# EAGLE design Feather_RCSwitch (EAGLE 9.3.0)
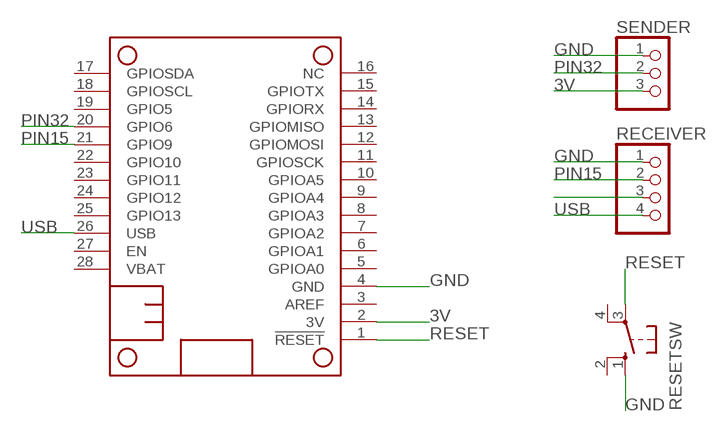
[diagram p0: schematic, sheet 1]

## Parts
MS1  FEATHERWING  [FEATHERWING]
RECEIVER  PINHD-1X4  [1X04]
RESETSW  10-XX  [B3F-10XX]
SENDER  PINHD-1X3  [1X03]

## Nets
3V: MS1.2(3V) SENDER.3
GND: MS1.4(GND) RECEIVER.1 RESETSW.1(S) SENDER.1
N$9: RECEIVER.3
PIN15: MS1.21(GPIO9) RECEIVER.2
PIN32: MS1.20(GPIO6) SENDER.2
RESET: MS1.1(!RESET) RESETSW.3(P)
USB: MS1.26(USB) RECEIVER.4
Unconnected: MS1.3(AREF) MS1.5(GPIOA0) MS1.6(GPIOA1) MS1.7(GPIOA2) MS1.8(GPIOA3) MS1.9(GPIOA4) MS1.10(GPIOA5) MS1.11(GPIOSCK) MS1.12(GPIOMOSI) MS1.13(GPIOMISO) MS1.14(GPIORX) MS1.15(GPIOTX) MS1.16(NC) MS1.17(GPIOSDA) MS1.18(GPIOSCL) MS1.19(GPIO5) MS1.22(GPIO10) MS1.23(GPIO11) MS1.24(GPIO12) MS1.25(GPIO13) MS1.27(EN) MS1.28(VBAT) RESETSW.2(S1) RESETSW.4(P1)

## Library data of the parts
MS1 = adafruit:FEATHERWING
RECEIVER = pinhead:PINHD-1X4: PIN HEADER
RESETSW = switch-omron:10-XX: OMRON SWITCH; MPN: B3F-1000; OC_FARNELL: 176432; OC_NEWARK: 36M3542
SENDER = pinhead:PINHD-1X3: PIN HEADER

## Board
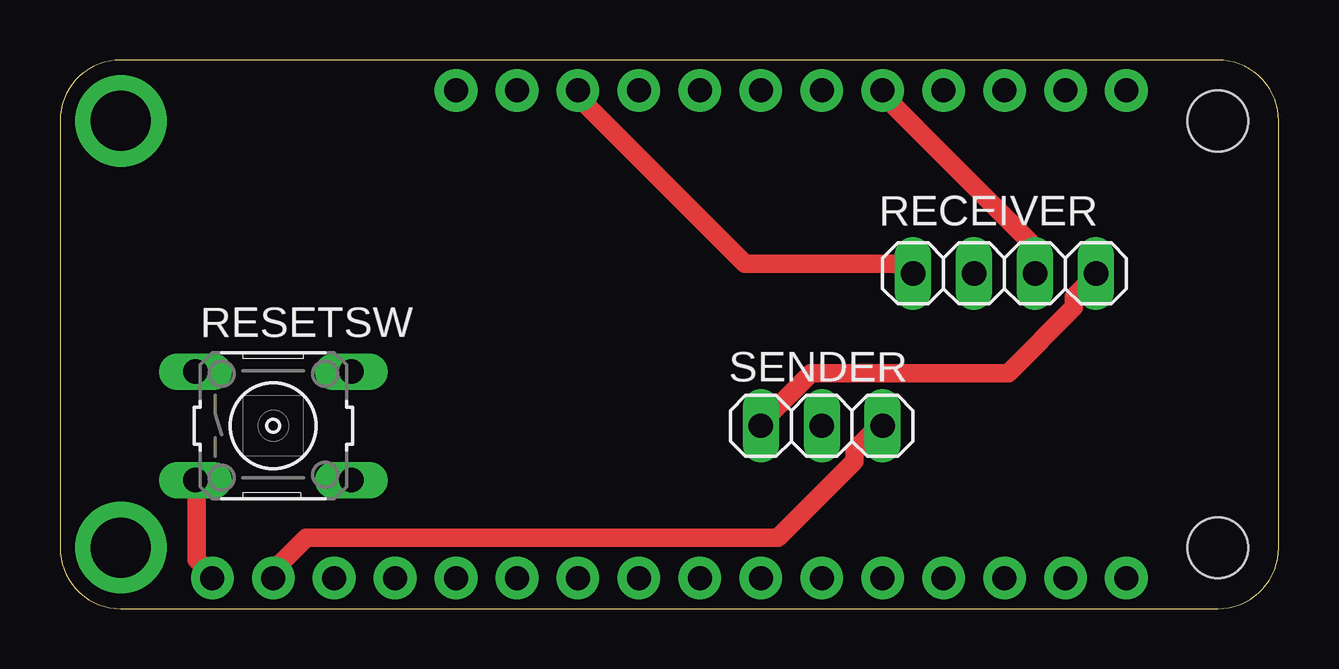
[diagram p1: board, top side]
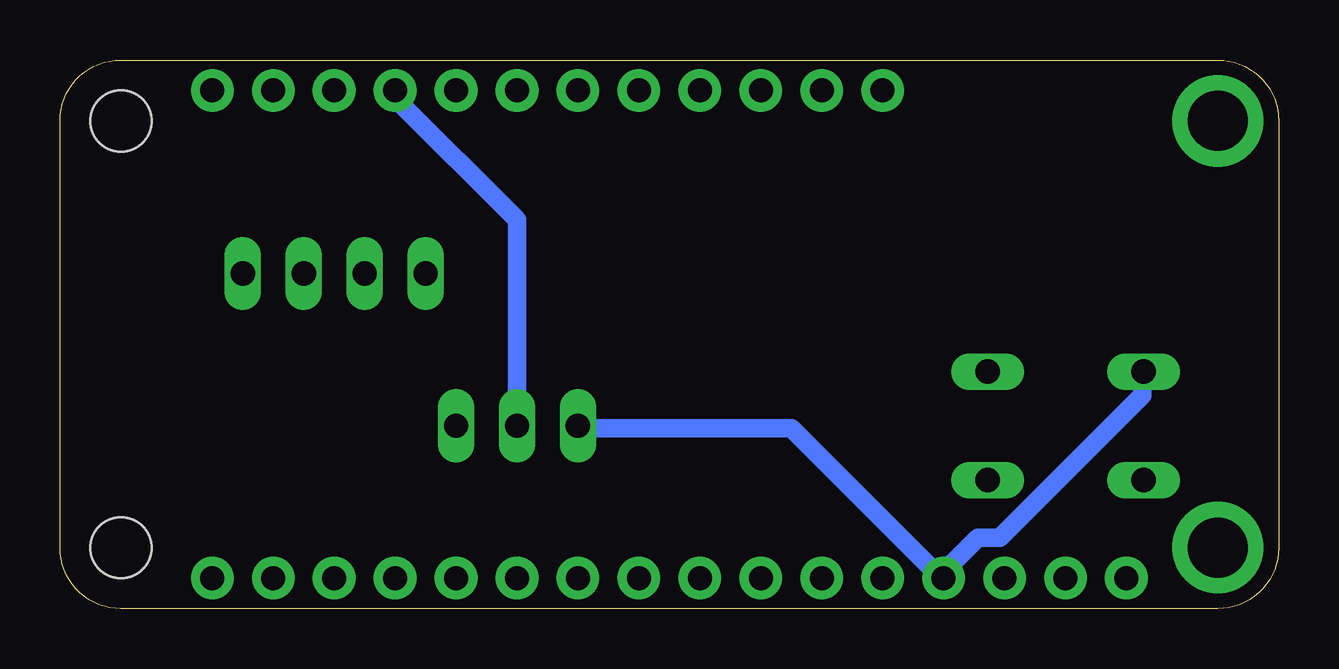
[diagram p2: board, bottom side, seen from below]

Size 50.8 x 22.86 mm. Coordinates in mm from the lower left corner, seen from the top.
Copper layers (1*16): Top 0.035mm / dielectric 1.5mm / Bottom 0.035mm
Design rules "default *": minimum track width 30mil, minimum drill 0.35mm, track to track 6mil, track to pad 6mil, pad to pad 6mil, via to via 6mil, smd to smd 6mil, copper to edge 40mil, drill to drill 6mil, minimum pad ring 10mil, minimum via ring 8mil, stop-mask expansion 4mil, vias tented up to drill 0mil, thermal gap 10mil

### Footprints (pad centres in the part's own frame; a part is rotated, then mirrored left to right if it is on the bottom)
FEATHERWING = drill 1 pad 1.778: 1 6.35,1.27; 2 8.89,1.27; 3 11.43,1.27; 4 13.97,1.27; 5 16.51,1.27; 6 19.05,1.27; 7 21.59,1.27; 8 24.13,1.27; 9 26.67,1.27; 10 29.21,1.27; 11 31.75,1.27; 12 34.29,1.27; 13 36.83,1.27; 14 39.37,1.27; 15 41.91,1.27; 16 44.45,1.27; 17 44.45,21.59; 18 41.91,21.59; 19 39.37,21.59; 20 36.83,21.59; 21 34.29,21.59; 22 31.75,21.59; 23 29.21,21.59; 24 26.67,21.59; 25 24.13,21.59; 26 21.59,21.59; 27 19.05,21.59; 28 16.51,21.59 | drill 2.5 pad 3.81: P$1 2.54,20.32; P$2 2.54,2.54 | hole 2.54: 48.26,20.32; 48.26,2.54
1X04 = drill 1.016 long: 1 -3.81,0; 2 -1.27,0; 3 1.27,0; 4 3.81,0
B3F-10XX = drill 1.016 long: 1 -3.251,2.261; 2 3.251,2.261; 3 -3.251,-2.261; 4 3.251,-2.261
1X03 = drill 1.016 long: 1 -2.54,0; 2 0,0; 3 2.54,0

### Placement (x,y rotation side)
MS1  0,0 0 top
RECEIVER  39.37,13.97 180 top
RESETSW  8.89,7.62 0 top
SENDER  31.75,7.62 0 top

### Tracks (layer width: path | path; a pad name or v marks a point on that pad's centre or on a via)
3V
  Top 0.762: SENDER.3 34.04,7.52 33.12,6.6 33.12,6.15 29.92,2.95 10.26,2.95 8.89,1.58 MS1.2
GND
  Top 0.762: RECEIVER.1 43.18,13.92 42.27,13 42.27,12.55 39.52,9.8 31.29,9.8 29.46,7.98 SENDER.1
  Bottom 0.762: SENDER.1 29.01,7.52 20.32,7.52 14.38,1.58 MS1.4 13.92,1.58 12.55,2.95 11.63,2.95 5.69,8.89 5.69,9.8 RESETSW.1
PIN15
  Top 0.762: RECEIVER.2 40.44,14.38 40.44,15.29 34.49,21.23 MS1.21
PIN32
  Bottom 0.762: SENDER.2 31.75,16.21 36.78,21.23 MS1.20
RESET
  Top 0.762: RESETSW.3 5.69,5.23 5.69,2.03 6.15,1.58 MS1.1
USB
  Top 0.762: RECEIVER.4 35.41,14.38 28.55,14.38 21.69,21.23 MS1.26